# EAGLE design dc-motor-noise-suppressor (EAGLE 5.02)
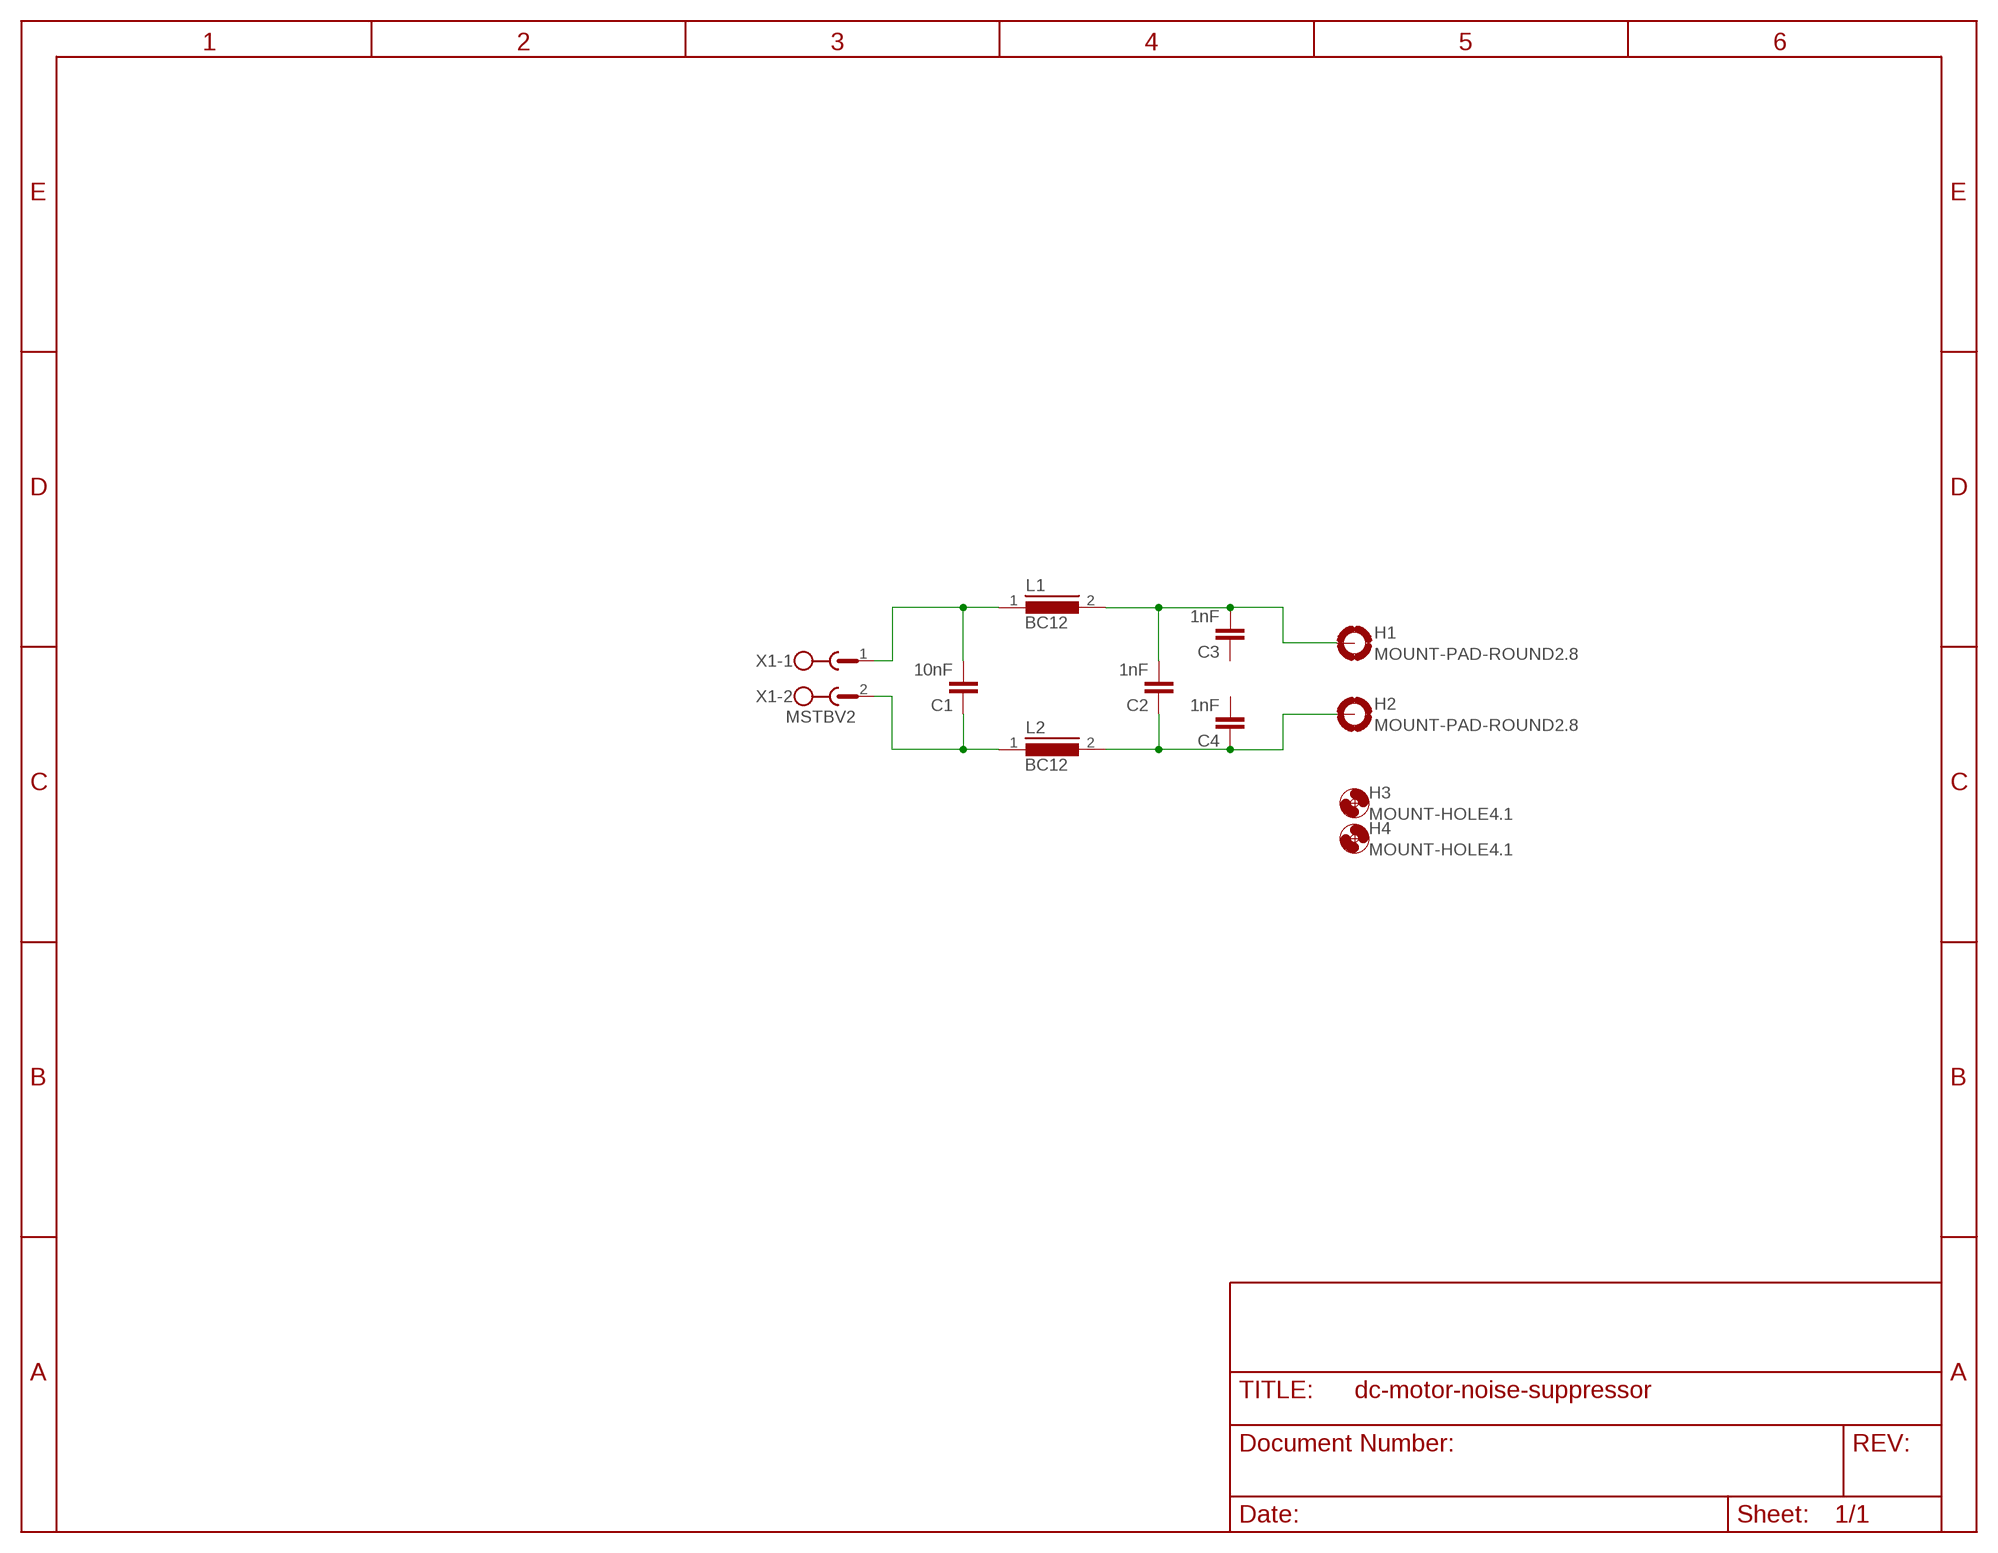
[diagram p0: schematic, sheet 1]

## Parts
C1  10nF  C-EU050-030X075  [C050-030X075]
C2  1nF  C-EU050-030X075  [C050-030X075]
C3  1nF  C-EU050-030X075  [C050-030X075]
C4  1nF  C-EU050-030X075  [C050-030X075]
H1  MOUNT-PAD-ROUND2.8  [2,8-PAD]
H2  MOUNT-PAD-ROUND2.8  [2,8-PAD]
H3  MOUNT-HOLE4.1  [4,1]
H4  MOUNT-HOLE4.1  [4,1]
L1  BC12  [BC12]
L2  BC12  [BC12]
X1  MSTBV2  [MSTBV2]

## Nets
N$1: C1.2 L1.1 X1.1
N$2: C1.1 L2.1 X1.2
N$3: C2.2 C3.2 H1.B2,8(MOUNT) L1.2
N$5: C2.1 C4.1 H2.B2,8(MOUNT) L2.2
Unconnected: C3.1 C4.2

## Library data of the parts
C1-C4 = rcl:C-EU: CAPACITOR, European symbol
H1 H2 = holes:MOUNT-PAD-ROUND: MOUNTING PAD, round
H3 H4 = holes:MOUNT-HOLE: MOUNTING HOLE with drill center marker
L1 L2 = inductors:BC12: INDUCTOR
X1 = con-phoenix-508:MSTBV2: PHOENIX

## Net classes
0 default: width 1.676 mm, clearance 0.406 mm

## Board
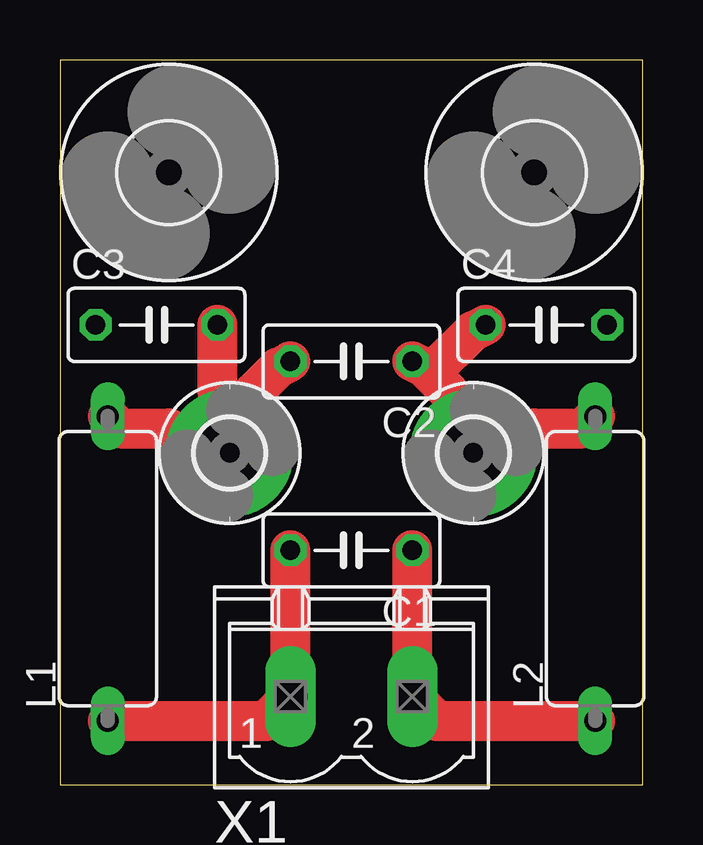
[diagram p1: board, top side]

Size 24.31 x 30.22 mm. Coordinates in mm from the lower left corner, seen from the top.
Outline: 0,0 24.31,0 24.31,30.22 0,30.22 0,0
Copper layers (1*16): Top 0.035mm / dielectric 1.5mm / Bottom 0.035mm
Design rules "default": minimum track width 10mil, minimum drill 24mil, track to track 8mil, track to pad 8mil, pad to pad 8mil, via to via 8mil, smd to smd 8mil, copper to edge 40mil, drill to drill 8mil, minimum pad ring 10mil, minimum via ring 8mil, stop-mask expansion 4mil, vias tented up to drill 0mil, thermal gap 10mil

### Footprints (pad centres in the part's own frame; a part is rotated, then mirrored left to right if it is on the bottom)
C050-030X075 = drill 0.813 octagon: 1 -2.54,0; 2 2.54,0
2,8-PAD = drill 2.8 pad 5.334 round: B2,8 0,0
4,1 = hole 4.1: 0,0
BC12 = drill 0.914 long: 1 -6.35,0; 2 6.35,0
MSTBV2 = drill 1.397 long: 1 -2.54,0; 2 2.54,0

### Placement (x,y rotation side)
C1  12.15,9.77 180 top
C2  12.15,17.65 180 top
C3  4.03,19.17 0 top
C4  20.28,19.17 0 top
H1  7.07,13.84 0 top
H2  17.23,13.84 0 top
H3  4.53,25.52 0 top
H4  19.77,25.52 0 top
L1  1.99,9.01 90 top
L2  22.31,9.01 90 top
X1  12.15,3.68 0 top

### Tracks (layer width: path | path; a pad name or v marks a point on that pad's centre or on a via)
N$1
  Top 1.676: C1.2 X1.1 8.6,2.66 L1.1
N$2
  Top 1.676: C1.1 X1.2 15.71,2.66 L2.1
N$3
  Top 1.676: C3.2 6.57,16.38 H1.B2,8 | C2.2 9.11,17.39 8.09,16.38 H1.B2,8 | L1.2 2.5,14.85 4.53,14.85 H1.B2,8
N$5
  Top 1.676: 15.46,17.14 16.22,16.38 H2.B2,8 19.77,14.85 21.81,14.85 L2.2 | 15.46,17.14 15.2,17.39 C2.1 | C4.1 17.23,18.92 15.46,17.14